# EAGLE design band-motor-teensy (EAGLE 7.7.0)
DATABASE: /Users/ingolia/Dropbox/Experiments/turbidostat/nephelometer/circuitry/partsdb.txt
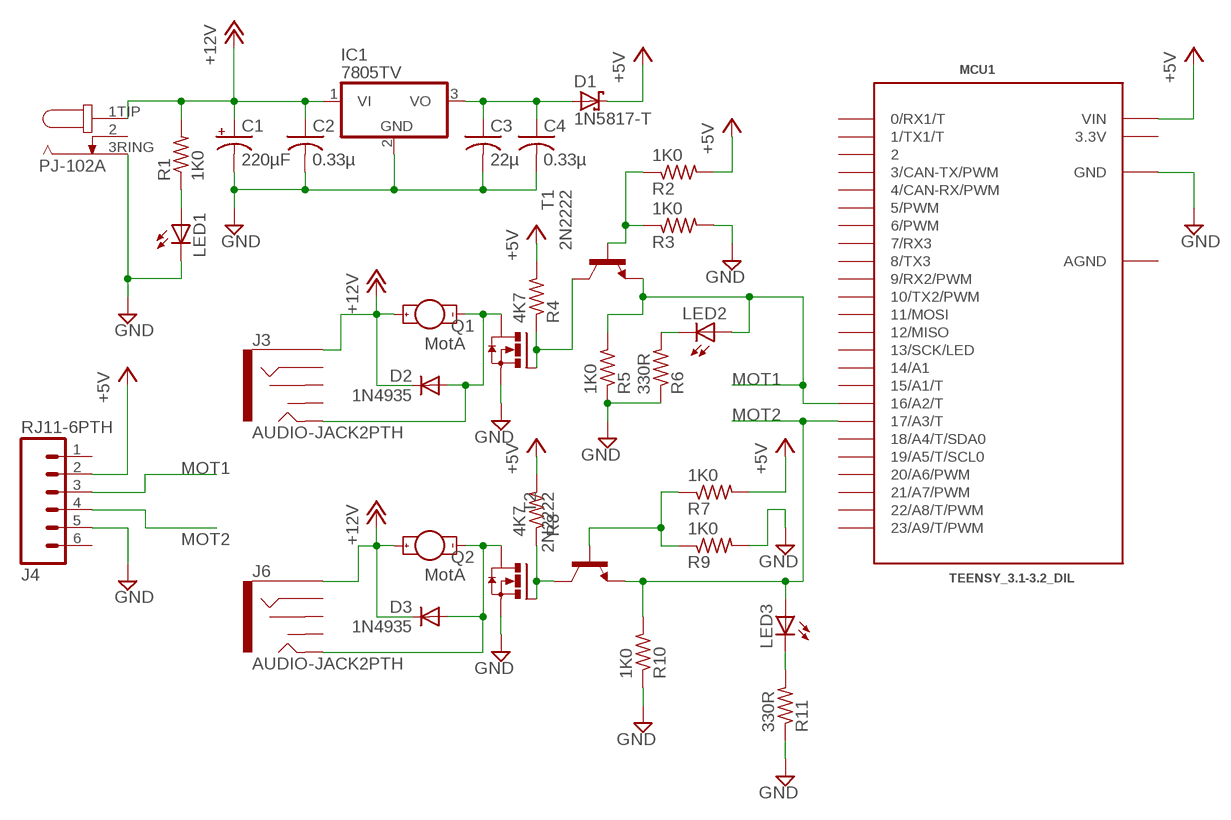
[diagram p0: schematic, sheet 1]

## Parts
C1  220µF  CPOL-USE3.5-8  [E3,5-8]
C2  0.33µ  C-US025-050X050  [C025-050X050]
C3  22µ  C-US050-045X075  [C050-045X075]
C4  0.33µ  C-US025-050X050  [C025-050X050]
D1  1N5817-T  [DO41-7.6]
D2  1N4935  1N4004  [DO41-10]
D3  1N4935  1N4004  [DO41-10]
IC1  7805TV  [TO220V]
J1  PJ-102A  [PJ-102A]
J2  MotA  1X02_3.5MM_MOT  [1X02_3.5MM_MOT]
J3  AUDIO-JACK2PTH  [AUDIO-JACK]
J4  RJ11-6PTH  [RJ11-6]
J5  MotA  1X02_3.5MM_MOT  [1X02_3.5MM_MOT]
J6  AUDIO-JACK2PTH  [AUDIO-JACK]
LED1  LED5MM  [LED5MM]
LED2  LED3MM  [LED3MM]
LED3  LED3MM  [LED3MM]
MCU1  TEENSY_3.1-3.2_DIL  [TEENSY_3.0-3.2&LC_DIL]
Q1  IRLB8721  [TO220BV]
Q2  IRLB8721  [TO220BV]
R1  1K0  R-US_0207/9  [0207/9]
R2  1K0  R-US_0207/10  [0207/10]
R3  1K0  R-US_0207/10  [0207/10]
R4  4K7  R-US_0207/10  [0207/10]
R5  1K0  R-US_0207/10  [0207/10]
R6  330R  R-US_0207/10  [0207/10]
R7  1K0  R-US_0207/10  [0207/10]
R8  4K7  R-US_0207/10  [0207/10]
R9  1K0  R-US_0207/10  [0207/10]
R10  1K0  R-US_0207/10  [0207/10]
R11  330R  R-US_0207/10  [0207/10]
T1  2N2222  [TO92-EBC-OVAL]
T2  2N2222  [TO92-EBC-OVAL]

## Nets
+5V: D1.C J4.2 MCU1.VIN R2.2 R4.2 R7.2 R8.2
+12V: C1.+ C2.1 D2.C D3.C IC1.1(VI) J1.1TIP(3TIP) J2.1A(+) J3.SLEEVE J5.1A(+) J6.SLEEVE R1.2
GND: C1.- C2.2 C3.2 C4.2 IC1.2(GND) J1.3RING(1RING) J4.5 LED1.K(C) MCU1.GND Q1.S Q2.S R3.2 R5.1 R6.1 R9.2 R10.1 R11.1
MOT1: J4.3 LED2.A MCU1.16/A2(16/A2/T) R5.2 T1.E
MOT2: J4.4 LED3.A MCU1.17/A3(17/A3/T) R10.2 T2.E
N$1: LED1.A R1.1
N$2: C3.1 C4.1 D1.A IC1.3(VO)
N$3: D3.A J5.2K(-) J6.TIP Q2.D
N$4: D2.A J2.2K(-) J3.TIP Q1.D
N$5: LED2.K(C) R6.2
N$6: R2.1 R3.1 T1.B
N$7: R7.1 R9.1 T2.B
N$8: Q1.G R4.1 T1.C
N$9: Q2.G R8.1 T2.C
N$16: LED3.K(C) R11.2
Unconnected: J1.2 J3.RING J3.RSH J3.TSH J4.1 J4.6 J6.RING J6.RSH J6.TSH MCU1.0(0/RX1/T) MCU1.1(1/TX1/T) MCU1.2 MCU1.3(3/CAN-TX/PWM) MCU1.4(4/CAN-RX/PWM) MCU1.5(5/PWM) MCU1.6(6/PWM) MCU1.7(7/RX3) MCU1.8(8/TX3) MCU1.9(9/RX2/PWM) MCU1.10(10/TX2/PWM) MCU1.11(11/MOSI) MCU1.12(12/MISO) MCU1.13(13/SCK/LED) MCU1.14/A0(14/A1) MCU1.15/A1(15/A1/T) MCU1.18/A4(18/A4/T/SDA0) MCU1.19/A5(19/A5/T/SCL0) MCU1.20/A6(20/A6/PWM) MCU1.21/A7(21/A7/PWM) MCU1.22/A8(22/A8/T/PWM) MCU1.23/A9(23/A9/T/PWM)

## Power pins joined to a net without a drawn wire
3.3V: MCU1.3.3V
AGND: MCU1.AGND

## Library data of the parts
C1 = adafruit:CPOL-US: POLARIZED CAPACITOR, American symbol; DIGIKEY#: P5166-ND; MANF: Panasonic Electronic Components; MANF#: ECA-1VM221
C2 C4 = adafruit:C-US: CAPACITOR, American symbol; DIGIKEY#: 445-5312-ND; MANF: TDK Corporation; MANF#: FK14X7R1H334K
C3 = adafruit:C-US: CAPACITOR, American symbol; DIGIKEY#: 445-8455-ND; MANF: TDK Corporation; MANF#: FK20X7R1C226M
D1 = diode:1N581*: 1.0A SCHOTTKY BARRIER RECTIFIER Source: http://www.diodes.com/datasheets/ds23001.pdf; DIGIKEY#: 1N5817FSCT-ND; MANF: Fairchild Semiconductor; MANF#: 1N5817
D2 D3 = adafruit:1N4004: DIODE General purpose 1N400x type rectifier (With bigger pads) http://www.ladyada.net/library/pcb/eaglelibrary.html; DIGIKEY#: 1N4935FSCT-ND; MANF: Fairchild Semiconductor; MANF#: 1N4935
IC1 = linear:78*: Positive VOLTAGE REGULATOR Source: http://cache.national.com/ds/LM/LM78L05.pdf http://www.fairchildsemi.com/ds/LM/LM7805.pdf; DIGIKEY#: LM7805CT-ND; MANF: Fairchild Semiconductor; MANF#: LM7805CT
J1 = ingolia:PJ-102A; DIGIKEY#: CP-102A-ND; MANF: CUI Inc.; MANF#: PJ-102A
J2 J5 = ingolia:1X02_3.5MM_MOT; DIGIKEY#: ED2740-ND; MANF: On Shore Technology Inc.; MANF#: OSTTE020104
J3 J6 = SparkFun-Connectors:AUDIO-JACK2: Stereo audio jack with bypass switches.; DIGIKEY#: CP1-3523N-ND; MANF: CUI Inc.; MANF#: SJ1-3523N
J4 = SparkFun-Connectors:RJ11-6: RJ11 Jack Simple 6 pin RJ11 jack. Commonly found on CAT3 devices and Microchip programmers. SKU: PRT-00132; DIGIKEY#: AE10383-ND; MANF: Assmann WSW Components; MANF#: -2004-1-4-LP-N-R
LED1 = adafruit:LED: LED OSRAM: - CHIPLED LG R971, LG N971, LY N971, LG Q971, LY Q971, LO R971, LY R971 LH N974, LH R974 LS Q976, LO Q976, LY Q976 LO Q996 - Hyper CHIPLED LW Q18S LB Q993, LB Q99A, LB R99A - SideLED LS A670, LO A670, LY A670, LG A670, LP A670 LB A673, LV A673, LT A673, LW A673 LH A674 LY A675 LS A676, LA A676, LO A676, LY A676, LW A676 LS A679, LY A679, LG A679 - Hyper Micro SIDELED® LS Y876, LA Y876, LO Y876, LY Y876 LT Y87S - SmartLED LW L88C, LW L88S LB L89C, LB L89S, LG L890 LS L89K, LO L89K, LY L89K LS L896, LA L896, LO L896, LY L896 - TOPLED LS T670, LO T670, LY T670, LG T670, LP T670 LSG T670, LSP T670, LSY T670, LOP T670, LYG T670 LG T671, LOG T671, LSG T671 LB T673, LV T673, LT T673, LW T673 LH T674 LS T676, LA T676, LO T676, LY T676, LB T676, LH T676, LSB T676, LW T676 LB T67C, LV T67C, LT T67C, LS T67K, LO T67K, LY T67K, LW E67C LS E67B, LA E67B, LO E67B, LY E67B, LB E67C, LV E67C, LT E67C LW T67C LS T679, LY T679, LG T679 LS T770, LO T770, LY T770, LG T770, LP T770 LB T773, LV T773, LT T773, LW T773 LH T774 LS E675, LA E675, LY E675, LS T675 LS T776, LA T776, LO T776, LY T776, LB T776 LHGB T686 LT T68C, LB T68C - Hyper Mini TOPLED® LB M676 - Mini TOPLED Santana® LG M470 LS M47K, LO M47K, LY M47K Source: http://www.osram.convergy.de/; DIGIKEY#: 754-1735-ND; MANF: Kingbright; MANF#: WP7113SGD
LED2 LED3 = adafruit:LED: LED OSRAM: - CHIPLED LG R971, LG N971, LY N971, LG Q971, LY Q971, LO R971, LY R971 LH N974, LH R974 LS Q976, LO Q976, LY Q976 LO Q996 - Hyper CHIPLED LW Q18S LB Q993, LB Q99A, LB R99A - SideLED LS A670, LO A670, LY A670, LG A670, LP A670 LB A673, LV A673, LT A673, LW A673 LH A674 LY A675 LS A676, LA A676, LO A676, LY A676, LW A676 LS A679, LY A679, LG A679 - Hyper Micro SIDELED® LS Y876, LA Y876, LO Y876, LY Y876 LT Y87S - SmartLED LW L88C, LW L88S LB L89C, LB L89S, LG L890 LS L89K, LO L89K, LY L89K LS L896, LA L896, LO L896, LY L896 - TOPLED LS T670, LO T670, LY T670, LG T670, LP T670 LSG T670, LSP T670, LSY T670, LOP T670, LYG T670 LG T671, LOG T671, LSG T671 LB T673, LV T673, LT T673, LW T673 LH T674 LS T676, LA T676, LO T676, LY T676, LB T676, LH T676, LSB T676, LW T676 LB T67C, LV T67C, LT T67C, LS T67K, LO T67K, LY T67K, LW E67C LS E67B, LA E67B, LO E67B, LY E67B, LB E67C, LV E67C, LT E67C LW T67C LS T679, LY T679, LG T679 LS T770, LO T770, LY T770, LG T770, LP T770 LB T773, LV T773, LT T773, LW T773 LH T774 LS E675, LA E675, LY E675, LS T675 LS T776, LA T776, LO T776, LY T776, LB T776 LHGB T686 LT T68C, LB T68C - Hyper Mini TOPLED® LB M676 - Mini TOPLED Santana® LG M470 LS M47K, LO M47K, LY M47K Source: http://www.osram.convergy.de/; DIGIKEY#: 754-1275-ND; MANF: Kingbright; MANF#: WP7113SRD/D
MCU1 = Teensy_3_and_LC_Series_Boards_v1.4:TEENSY_3.1-3.2_DIL: Teensy 3.1 or 3.2 in a DIL Layout.; DIGIKEY#: SAM1198-14-ND; DIGIKEY2#: SAM1198-14-ND; MANF: Samtec Inc.; MANF#: SSQ-114-03-G-S; MANF2: Samtec Inc.; MANF2#: SSQ-114-03-G-S
Q1 Q2 = ingolia:IRLB8721; DIGIKEY#: IRLB8721PBF-ND; MANF: International Rectifier; MANF#: IRLB8721PBF
R1 = adafruit:R-US_: RESISTOR, American symbol; DIGIKEY#: S1KHCT-ND; MANF: Stackpole Electronics Inc.; MANF#: CFM12JT1K00
R2 R3 R5 R7 R9 R10 = adafruit:R-US_: RESISTOR, American symbol; DIGIKEY#: S1KHCT-ND; MANF: Stackpole Electronics Inc; MANF#: CFM12JT1K00
R4 R8 = adafruit:R-US_: RESISTOR, American symbol; DIGIKEY#: CF14JT4K70CT-ND; MANF: Stackpole Electronics Inc; MANF#: CF14JT4K70
R6 R11 = adafruit:R-US_: RESISTOR, American symbol; DIGIKEY#: CF14JT330RCT-ND; MANF: Stackpole Electronics Inc; MANF#: CF14JT330R
T1 T2 = adafruit:2N2222: NPN TRANSISTOR Big oval pads; DIGIKEY#: PN2222ATFCT-ND; MANF: Fairchild Semiconductor; MANF#: PN2222ATF

## Board
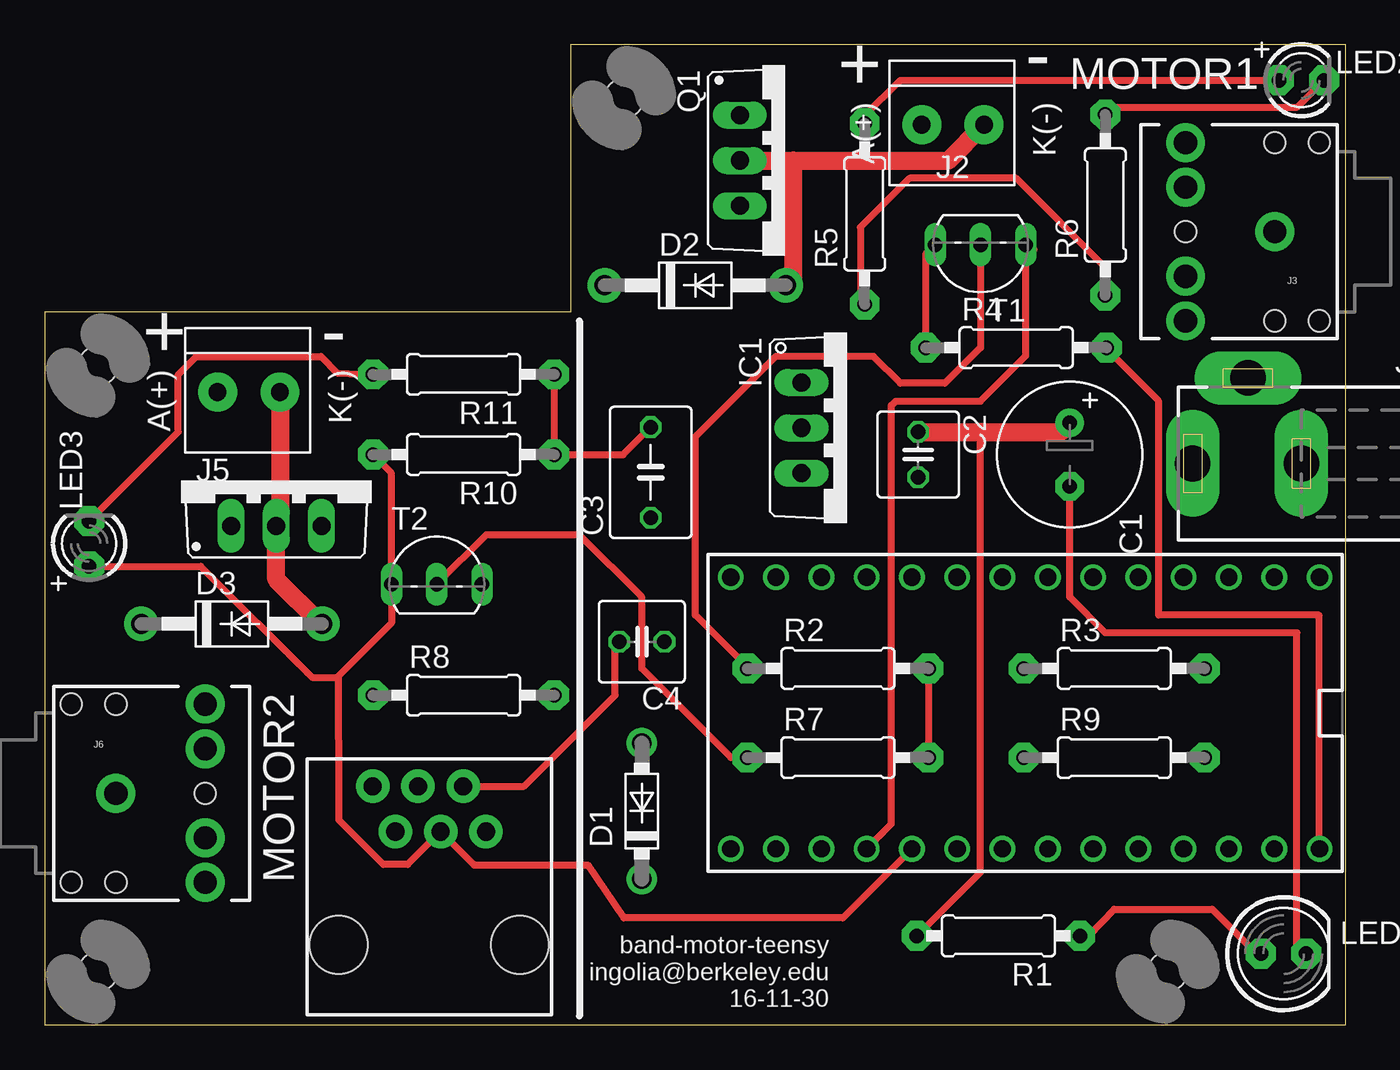
[diagram p1: board, top side]
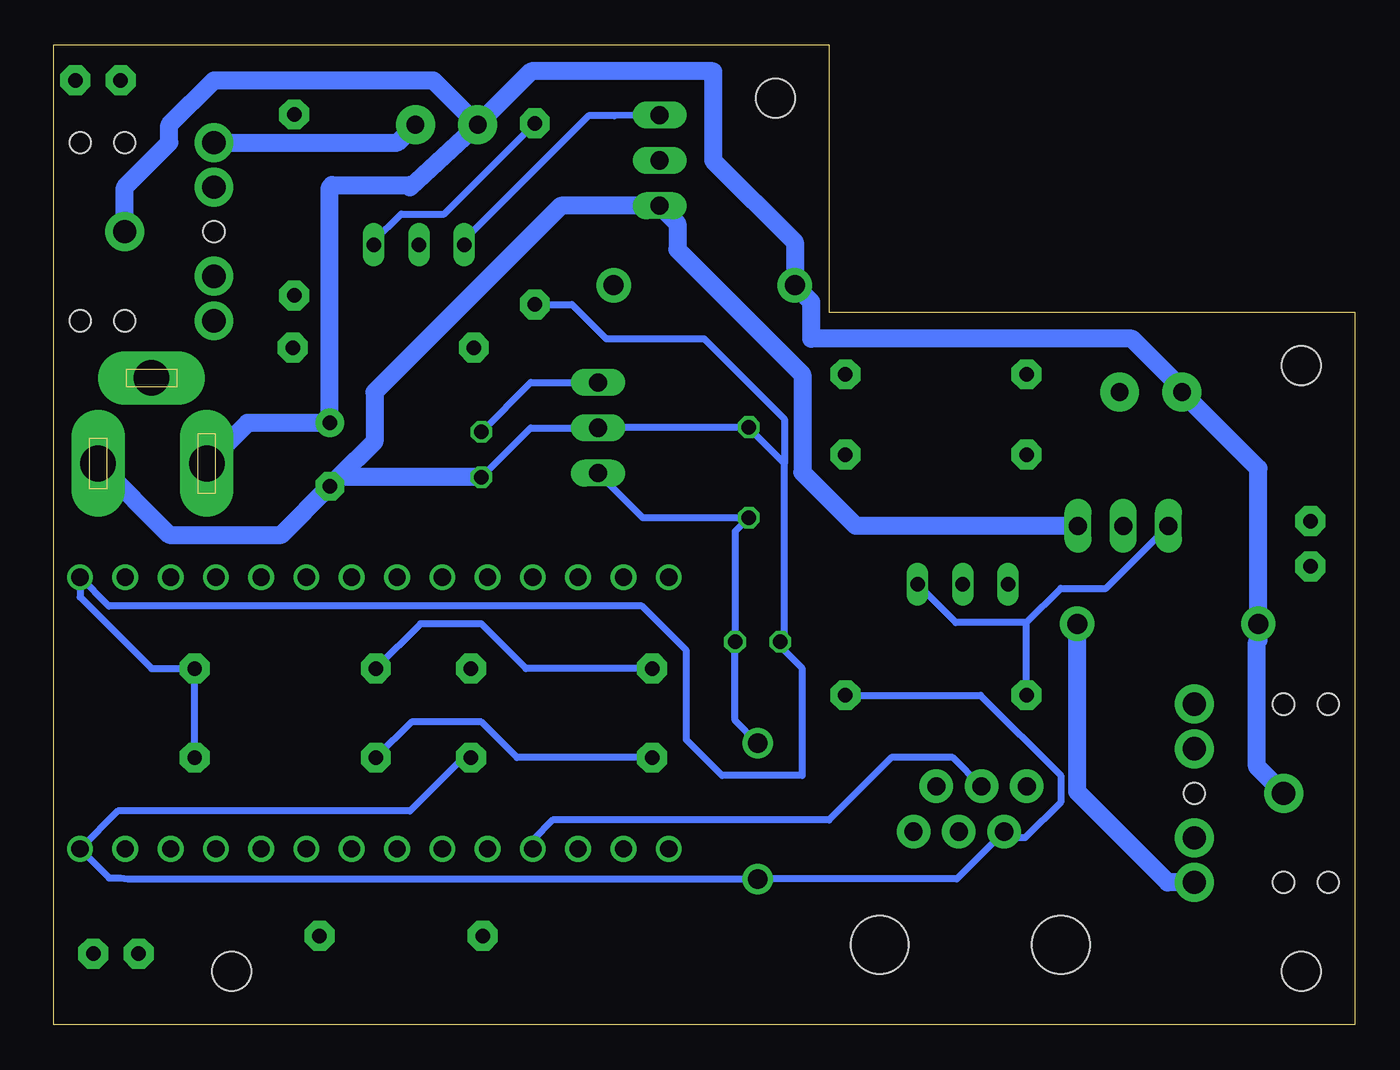
[diagram p2: board, bottom side, seen from below]

Size 73 x 55 mm. Coordinates in mm from the lower left corner, seen from the top.
Outline: 0,0 73,0 73,55 29.5,55 29.5,40 0,40 0,0
Copper layers (1*16): Top 0.0356mm / dielectric 1.5011mm / Bottom 0.0356mm
Design rules "OSHPark-LaenPCBOrder": minimum track width 6mil, minimum drill 13mil, track to track 6mil, track to pad 6mil, pad to pad 6mil, via to via 6mil, smd to smd 6mil, copper to edge 15mil, drill to drill 6mil, minimum pad ring 7mil, minimum via ring 7mil, stop-mask expansion 3mil, vias tented up to drill 0mil, thermal gap 10mil

### Footprints (pad centres in the part's own frame; a part is rotated, then mirrored left to right if it is on the bottom)
E3,5-8 = drill 0.813 pad 1.6: + -1.778,0 | drill 0.813 pad 1.6 octagon: - 1.778,0
C025-050X050 = drill 0.813 octagon: 1 -1.27,0; 2 1.27,0
C050-045X075 = drill 0.813 octagon: 1 -2.54,0; 2 2.54,0
DO41-7.6 = drill 1.1 pad 1.7: A 3.81,0; C -3.81,0
DO41-10 = drill 1.118 pad 1.93: A 5.08,0; C -5.08,0
TO220V = drill 1.016 long: 1 -2.54,-2.54; 2 0,-2.54; 3 2.54,-2.54
PJ-102A = drill 2 pad 2.54 long: 1TIP 0,3.1; 2 4.8,0; 3RING 0,-3
1X02_3.5MM_MOT = drill 1 pad 2.184: 1A 1.8,0; 2K -1.7,0
AUDIO-JACK = drill 1.3 pad 2.184: RING 5,5; RSH 5,2.5; SLEEVE 0,0; TIP 5,-5; TSH 5,-2.5 | hole 1.2: 0,5; -2.5,5; -2.5,-5; 0,-5; 5,0
RJ11-6 = drill 1.016 pad 1.88: 1 1.905,8.89; 2 3.175,6.35; 3 4.445,8.89; 4 5.715,6.35; 5 6.985,8.89; 6 8.255,6.35 | hole 3.251: 0,0; 10.16,0
LED5MM = drill 0.813 pad 1.676 octagon: A -1.27,0; K 1.27,0
LED3MM = drill 0.813 pad 1.676 octagon: A -1.27,0; K 1.27,0
TEENSY_3.0-3.2&LC_DIL = drill 0.965: 0 -7.62,13.97; 1 -7.62,11.43; 2 -7.62,8.89; 3 -7.62,6.35; 3.3V 7.62,11.43; 4 -7.62,3.81; 5 -7.62,1.27; 6 -7.62,-1.27; 7 -7.62,-3.81; 8 -7.62,-6.35; 9 -7.62,-8.89; 10 -7.62,-11.43; 11 -7.62,-13.97; 12 -7.62,-16.51; 13 7.62,-16.51; 14/A0 7.62,-13.97; 15/A1 7.62,-11.43; 16/A2 7.62,-8.89; 17/A3 7.62,-6.35; 18/A4 7.62,-3.81; 19/A5 7.62,-1.27; 20/A6 7.62,1.27; 21/A7 7.62,3.81; 22/A8 7.62,6.35; 23/A9 7.62,8.89; AGND 7.62,13.97; GND -7.62,16.51; VIN 7.62,16.51
TO220BV = drill 1.016 long: D 0,0; G -2.54,0; S 2.54,0
0207/9 = drill 0.813 pad 1.676 octagon: 1 -4.572,0; 2 4.572,0
0207/10 = drill 0.813 pad 1.676 octagon: 1 -5.08,0; 2 5.08,0
TO92-EBC-OVAL = drill 0.813 long: B 0,-1.27; C 2.54,-1.27; E -2.54,-1.27
M2MOUNT = hole 2.2: 0,0

### Placement (x,y rotation side)
C1  57.5,32 270 top
C2  49,32 270 top
C3  34,31 90 top
C4  33.5,21.5 180 top
D1  33.5,12 90 top
D2  36.5,41.5 0 top
D3  10.5,22.5 0 top
IC1  45,33.5 270 top
J1  67.5,31.5 90 top
J2  51,50.5 180 top
J3  69,44.5 180 top
J4  16.5,4.5 0 top
J5  11.5,35.5 180 top
J6  4,13 0 top
LED1  69.5,4 0 top
LED2  70.5,53 0 top
LED3  2.5,27 90 top
MCU1  55,17.5 270 top
Q1  39,48.5 270 top
Q2  13,28 0 top
R1  53.5,5 180 top
R2  44.5,20 0 top
R3  60,20 0 top
R4  54.5,38 0 top
R5  46,45.5 90 top
R6  150R  [0207/10]  59.5,46 90 top
R7  44.5,15 0 top
R8  23.5,18.5 0 top
R9  60,15 0 top
R10  23.5,32 180 top
R11  150R  [0207/10]  23.5,36.5 180 top
T1  52.5,42.5 180 top
T2  22,26 0 top
U$3  [M2MOUNT]  3,3 0 top
U$4  [M2MOUNT]  3,37 0 top
U$6  [M2MOUNT]  32.5,52 0 top
U$7  [M2MOUNT]  63,3 0 top

### Tracks (layer width: path | path; a pad name or v marks a point on that pad's centre or on a via)
+5V
  Top 0.406: 59.58,38.58 R4.2 59.58,37.92 62.5,35 62.5,23 71.5,23 MCU1.VIN | R2.2 R7.2
  Bottom 0.406: R8.2 21,18.5 16.5,14 16.5,12.5 18.5,10.5 19.32,10.5 J4.2 22.34,8.19 D1.C 68.81,8.19 69.25,8.25 69.88,8.25 MCU1.VIN 69.39,12 53,12 50,15 R7.2
+12V
  Top 0.406: R1.2 52.5,8.57 52.5,33.27
  Top 1.016: C2.1 52.5,33.27 56.99,33.27 C1.+
  Bottom 0.406: C2.1 46.23,36.04 IC1.1
  Bottom 1.016: J1.1TIP 62.12,33.78 C1.+ 57.5,47 57.38,47.12 53,47.12 53,47 J2.1A | J3.SLEEVE 69,47 66.5,49.5 66.5,50.5 64,53 51.7,53 J2.1A | J2.1A 46.2,53.5 36,53.5 36,48.5 31.42,43.92 D2.C 30.5,40.58 30.5,38.5 12.5,38.5 9.7,35.7 J5.1A 5.42,31.22 D3.C 5.42,21.58 5.5,21.5 5.5,14.5 J6.SLEEVE
GND
  Top 0.406: LED1.K 70.25,4.52 70.25,22 59.5,22 57.5,24 C1.- | J4.5 26.89,13.39 32,18.5 32,21.27 C4.2 | C3.2 32.46,32 R10.1 R11.1 | R6.1 59.5,42.5 54.5,47.5 48.5,47.5 45.75,44.75 45.75,40.67 R5.1
  Bottom 0.406: C2.2 46.23,33.5 IC1.2 41,33.54 C3.2 34,33.5 32,31.5 | 32,31.5 32,21.73 C4.2 32.23,21.23 31,20 31,14 35.5,14 37.5,16 37.5,21 40,23.5 69.89,23.5 MCU1.GND 71.51,24.01 67.5,20 R3.2 R9.2 | R5.1 43.92,40.42 42,38.5 36.5,38.5 32,34 32,31.5
  Bottom 1.016: J1.3RING 66.5,27.5 60.22,27.5 C1.- 56.99,30.73 | 56.99,30.73 55,32.72 55,35.5 44.54,45.96 Q1.S 38,44.96 38,43.5 31,36.5 31,31 28,28 Q2.S | C2.2 56.99,30.73
MOT1
  Top 0.406: MCU1.16/A2 47.5,11.27 47.5,34.75 47.75,35 52.5,35 55.04,37.54 55.04,43.04 55.5,43.5 55.31,43.5 T1.E | LED2.A 48,53 46,51 R5.2
  Bottom 0.406: J4.3 22.55,15 26,15 29.5,11.5 45,11.5 46.11,10.39 MCU1.16/A2 | T1.E 55.04,43.96 53.5,45.5 51.08,45.5 R5.2
MOT2
  Top 0.406: MCU1.17/A3 44.77,6 32.5,6 30.47,8.98 24.08,8.98 J4.4 20.36,9 19,9 16.5,11.5 16.5,12.5 16.46,19.5 | 16.46,19.5 16.46,19.54 19.46,22.54 T2.E 19.46,30.96 R10.2 | LED3.A 8.77,25.73 15,19.5 16.46,19.5
N$1
  Top 0.406: R1.1 58.57,5 60,6.5 65.5,6.5 68,4 LED1.A
N$2
  Bottom 0.406: IC1.3 39.96,28.46 C3.1 34.77,27.69 C4.1 34.77,17.08 D1.A
N$3
  Top 1.016: D3.A 15.5,22.5 13,25 13,27.5 | 13,27.5 Q2.D | J5.2K 13.2,27.7 13,27.5
  Bottom 1.016: J6.TIP 10.5,8 15.58,13.08 D3.A
N$4
  Top 1.016: Q1.D 42,48.5 | 42,48.5 50.7,48.5 J2.2K | D2.A 42,41.92 42,48.5
  Bottom 1.016: J3.TIP 53.7,49.5 J2.2K
N$5
  Top 0.406: R6.2 59.92,51.5 70.27,51.5 LED2.K
N$6
  Top 0.406: R2.1 39.42,20.08 36.5,23 36.5,33 41,37.5 46.5,37.5 48,36 50.5,36 52.5,38 T1.B
  Bottom 0.406: R2.1 46.5,20 49,22.5 52.42,22.5 R3.1
N$7
  Top 0.406: R7.1 38.5,15 33.5,20 33.5,24 30,27.5 24.77,27.5 T2.B
  Bottom 0.406: R7.1 47,15 49,17 52.92,17 R9.1
N$8
  Top 0.406: T1.C 49.42,43.23 R4.1
  Bottom 0.406: Q1.G 41.54,51 43,51 49.96,44.04 T1.C
N$9
  Bottom 0.406: R8.1 18.42,22.58 | 18.42,22.58 16.5,24.5 13.96,24.5 Q2.G | 18.42,22.58 22.39,22.58 T2.C
N$16
  Top 0.406: LED3.K 7.5,33.27 7.5,36.5 8.5,37.5 15.5,37.5 16.42,36.58 R11.2

### Text on the board
tPlace: band-motor-teensy / ingolia@berkeley.edu / 16-11-30
tNames: + | - | MOTOR1 | + | - | MOTOR2